# Altium schematic sheet MCU.SchDoc
size A4; SheetNumber: 6; SheetTotal: 7
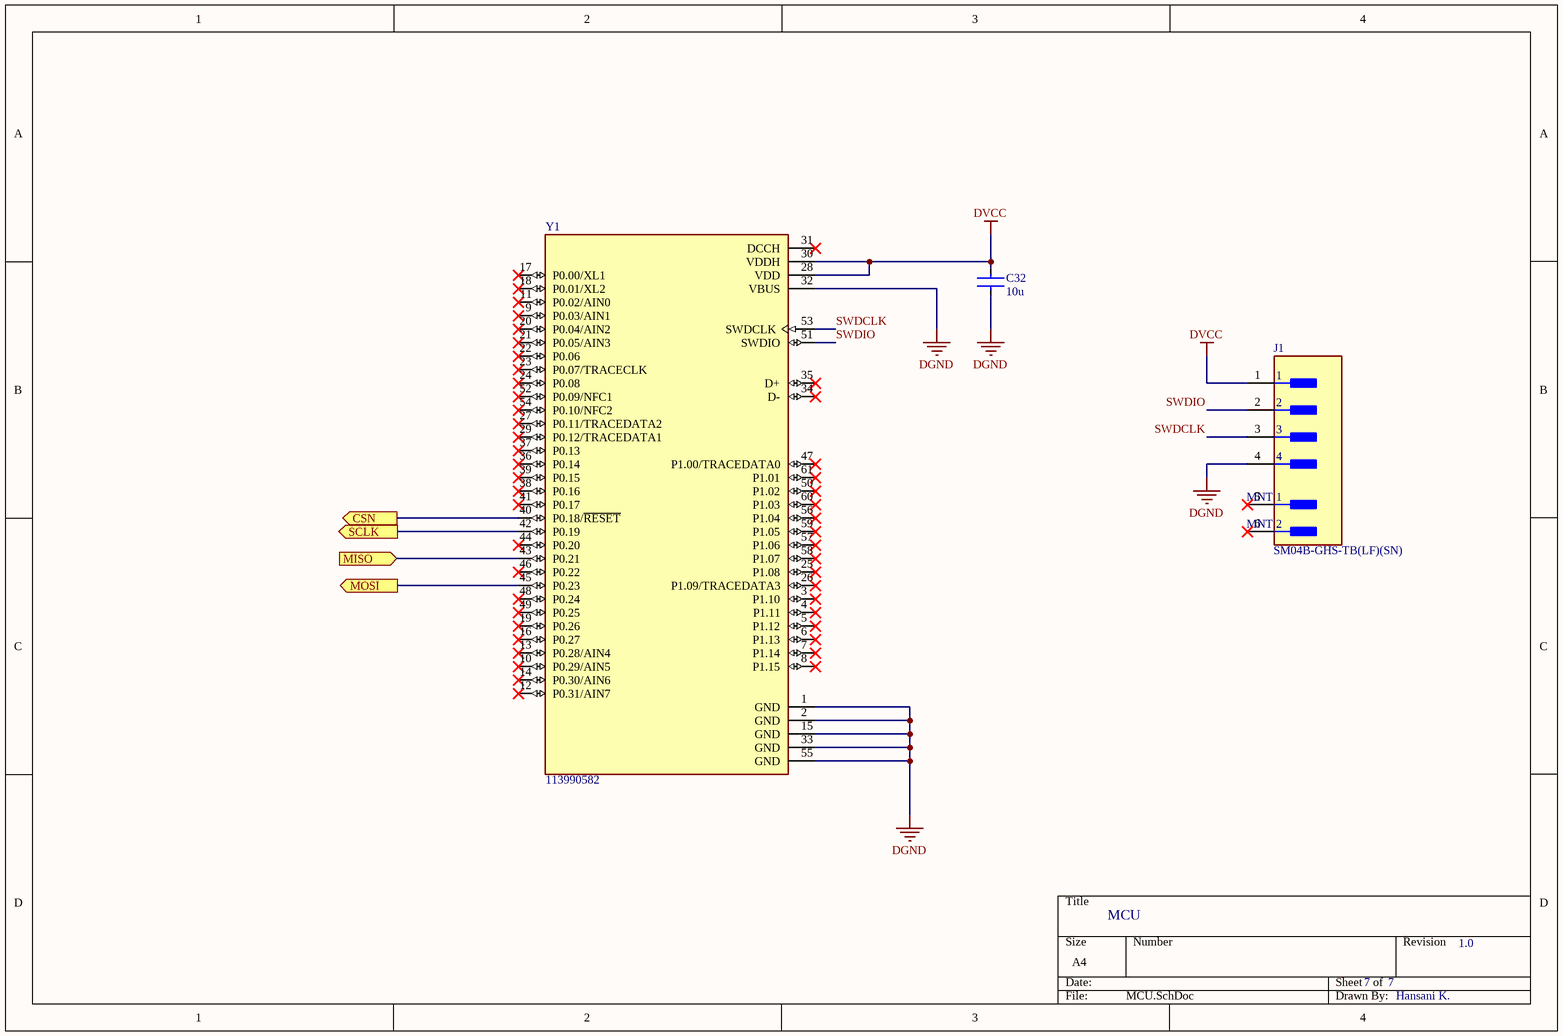
[diagram p0: MCU.SchDoc]

## Parts
C32  10u  [PCBComponent_1]
J1  SM04B-GHS-TB(LF)(SN)  [FP-SM04B-GHS-TB_LF_SN-MFG]
Y1  113990582  [XCVR_MDBT50Q-1MV2]

## Ports
CSN (out, see Wireless_ECG_Monitor[3C], ADC[3C]), MISO (in, see Wireless_ECG_Monitor[3C], ADC[4C]), MOSI (out, see Wireless_ECG_Monitor[3C], ADC[3C]), SCLK (out, see Wireless_ECG_Monitor[3C], ADC[3C])

## Nets
DGND: C32.1 J1.4 Y1.1(GND) Y1.2(GND) Y1.15(GND) Y1.32(VBUS) Y1.33(GND) Y1.55(GND)
DVCC: C32.2 J1.1 Y1.28(VDD) Y1.30(VDDH)
CSN: Y1.40(P0.18/~{RESET}) ; port CSN
MISO: Y1.43(P0.21) ; port MISO
MOSI: Y1.45(P0.23) ; port MOSI
SCLK: Y1.42(P0.19) ; port SCLK
SWDCLK: J1.3 Y1.53(SWDCLK)
SWDIO: J1.2 Y1.51(SWDIO)

Not connected (* = marked no-connect by the designer): J1 5(MNT_1)* 6(MNT_2)*; Y1 3(P1.10)* 4(P1.11)* 5(P1.12)* 6(P1.13)* 7(P1.14)* 8(P1.15)* 9(P0.03/AIN1)* 10(P0.29/AIN5)* 11(P0.02/AIN0)* 12(P0.31/AIN7)* 13(P0.28/AIN4)* 14(P0.30/AIN6)* 16(P0.27)* 17(P0.00/XL1)* 18(P0.01/XL2)* 19(P0.26)* 20(P0.04/AIN2)* 21(P0.05/AIN3)* 22(P0.06)* 23(P0.07/TRACECLK)* 24(P0.08)* 25(P1.08)* 26(P1.09/TRACEDATA3)* 27(P0.11/TRACEDATA2)* 29(P0.12/TRACEDATA1)* 31(DCCH)* 34(D-)* 35(D+)* 36(P0.14)* 37(P0.13)* 38(P0.16)* 39(P0.15)* 41(P0.17)* 44(P0.20)* 46(P0.22)* 47(P1.00/TRACEDATA0)* 48(P0.24)* 49(P0.25)* 50(P1.02)* 52(P0.09/NFC1)* 54(P0.10/NFC2)* 56(P1.04)* 57(P1.06)* 58(P1.07)* 59(P1.05)* 60(P1.03)* 61(P1.01)*

## Notes on the sheet
- MCU
- 7
- 1.0
- Hansani K.

## Library data of the parts
C32 = TM8R106K010UBA: Surface Mount Tantalum Capacitor, 10 uF, 10 V, ± 10%, -55 °C, 125 °C, 0805 [2012-15 Metric]; Manufacturer: Vishay; Value: 10µF; Dissipation Factor: 8%; ESR (Equivalent Series Resistance): 6Ω; Leakage Current: 500nA; Voltage Rating: 10V; Supplier: DigiKey; Supplier Part Number: 718-1726-1-ND; Manufacturer Part Number: TM8R106K010UBA; RoHS: Compliant; Category: Tantalum Capacitors; Stock: 1990; Pricing: 1=11.05, 10=8.454, 50=7.4158, 100=7.191 (USD); Case/Package: 0805; Case Code (Imperial): 0805; Case Code (Metric): 2012; Depth: 1.35mm; Height: 1.47mm; Height - Seated (Max): 1.5748mm; Lead Free: Lead Free; Length: 2.06mm; Lifecycle Status: Production; Max Operating Temperature: 125°C; Min Operating Temperature: -55°C; Mounting Technology: Surface Mount; Pins: 2; Number of Terminals: 2; Packaging: Digi-Reel®; Radiation Hardening: No; REACH SVHC: Yes; Schedule B: 8532210050, 8532210050|8532210050|8532210050|8532210050|8532210050; Termination: SMD/SMT; Tolerance: 10%; Voltage Rating (DC): 10V; Weight: 5.499807mg; Width: 1.35mm; ComponentLink1URL: https://datasheet.octopart.com:443/TM8R106K010UBA-Vishay-datasheet-182138853.pdf?src-supplier=IHS; ComponentLink1Description: https://datasheet.octopart.com:443/TM8R106K010UBA-Vishay-datasheet-182138853.pdf?src-supplier=IHS; ComponentLink2URL: https://datasheet.octopart.com:443/TM8R106K010UBA-Vishay-datasheet-189768107.pdf?src-supplier=ODG+(Origin+Data+Global); ComponentLink2Description: https://datasheet.octopart.com:443/TM8R106K010UBA-Vishay-datasheet-189768107.pdf?src-supplier=ODG+(Origin+Data+Global); ComponentLink3URL: https://datasheet.octopart.com:443/TM8R106K010UBA-Vishay-datasheet-8816891.pdf?src-supplier=Newark; ComponentLink3Description: https://datasheet.octopart.com:443/TM8R106K010UBA-Vishay-datasheet-8816891.pdf?src-supplier=Newark; ComponentLink4URL: https://datasheet.octopart.com:443/TM8R106K010UBA-Vishay-datasheet-78862796.pdf?src-supplier=Newark; ComponentLink4Description: https://datasheet.octopart.com:443/TM8R106K010UBA-Vishay-datasheet-78862796.pdf?src-supplier=Newark; ComponentLink5URL: https://datasheet.octopart.com:443/TM8R106K010UBA-Vishay-datasheet-12551717.pdf?src-supplier=Future+Electronics; ComponentLink5Description: https://datasheet.octopart.com:443/TM8R106K010UBA-Vishay-datasheet-12551717.pdf?src-supplier=Future+Electronics; ComponentLink6URL: https://datasheet.octopart.com:443/TM8R106K010UBA-Vishay-datasheet-12535145.pdf?src-supplier=Future+Electronics; ComponentLink6Description: https://datasheet.octopart.com:443/TM8R106K010UBA-Vishay-datasheet-12535145.pdf?src-supplier=Future+Electronics; ComponentLink7URL: https://datasheet.octopart.com:443/TM8R106K010UBA-Vishay-datasheet-12516337.pdf?src-supplier=Future+Electronics; ComponentLink7Description: https://datasheet.octopart.com:443/TM8R106K010UBA-Vishay-datasheet-12516337.pdf?src-supplier=Future+Electronics; ComponentLink8URL: https://datasheet.octopart.com:443/TM8R106K010UBA-Vishay-datasheet-12512816.pdf?src-supplier=Future+Electronics; ComponentLink8Description: https://datasheet.octopart.com:443/TM8R106K010UBA-Vishay-datasheet-12512816.pdf?src-supplier=Future+Electronics; ComponentLink9URL: http://sigma.octopart.com:80/rohs_statement/Vishay-company-15.pdf?src-supplier=Compliance+Statements; ComponentLink9Description: http://sigma.octopart.com:80/rohs_statement/Vishay-company-15.pdf?src-supplier=Compliance+Statements
J1 = CMP-17439-000411-1: CONN HEADER SMD R/A 4POS 1.25MM; Voltage Rating: 50V; Number of Contacts: 4; Current Rating: 1A; Termination: Solder; Mount: Surface Mount; REACH SVHC: No SVHC; Packaging: Cut Tape; Contact Material: Bronze; Series: GH; Orientation: Right Angle; Lead Free: Lead Free; Housing Material: Nylon; Contact Plating: Tin; Housing Color: Natural; Number of Rows: 1; Pitch: 1.25mm; Number of Positions: 4
Y1 = 113990582: Bluetooth v4.2 (BLE)/v5.0 SMART SOC 2Mbps 61-Pin SMD Module; Manufacturer: Seeed Studio; Supplier: DigiKey; Supplier Part Number: 1597-1678-ND; Manufacturer Part Number: 113990582; Category: RF Transceiver Modules and Modems; Pricing: 1=10.1 (USD); Schedule B: 8517700000; ComponentLink1URL: https://datasheet.octopart.com:443/113990582-Seeed-Studio-datasheet-189768011.pdf?src-supplier=ODG+(Origin+Data+Global); ComponentLink1Description: https://datasheet.octopart.com:443/113990582-Seeed-Studio-datasheet-189768011.pdf?src-supplier=ODG+(Origin+Data+Global)